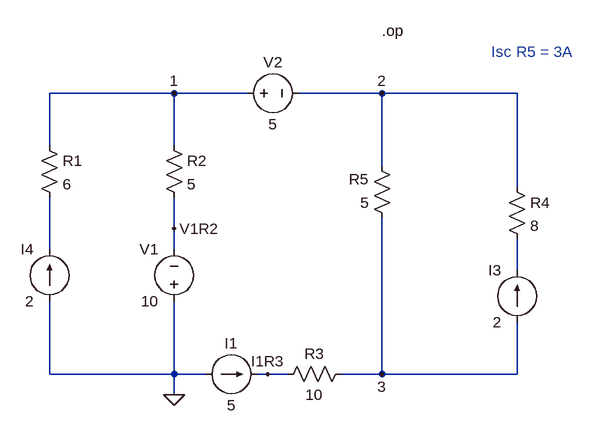
[diagram p0: schematic Circuit_tema1.asc]
Circuit_tema1.asc, the LTspice schematic file:
Version 4
SHEET 1 1772 680
WIRE 288 0 96 0
WIRE 400 0 288 0
WIRE 608 0 480 0
WIRE 816 0 608 0
WIRE 96 80 96 0
WIRE 288 80 288 0
WIRE 608 112 608 0
WIRE 816 144 816 0
WIRE 288 208 288 160
WIRE 96 240 96 160
WIRE 288 240 288 208
WIRE 816 272 816 224
WIRE 96 432 96 320
WIRE 288 432 288 320
WIRE 288 432 96 432
WIRE 336 432 288 432
WIRE 432 432 416 432
WIRE 464 432 432 432
WIRE 608 432 608 192
WIRE 608 432 544 432
WIRE 816 432 816 352
WIRE 816 432 608 432
WIRE 288 464 288 432
FLAG 288 0 1
FLAG 608 0 2
FLAG 608 432 3
FLAG 288 464 0
FLAG 288 208 V1R2
FLAG 432 432 I1R3
SYMBOL res 80 64 R0
SYMATTR InstName R1
SYMATTR Value 6
SYMBOL res 272 64 R0
SYMATTR InstName R2
SYMATTR Value 5
SYMBOL voltage 288 336 R180
WINDOW 0 24 96 Left 2
WINDOW 3 24 16 Left 2
SYMATTR InstName V1
SYMATTR Value 10
SYMBOL current 336 432 R270
WINDOW 0 32 40 VTop 2
WINDOW 3 -32 40 VBottom 2
SYMATTR InstName I1
SYMATTR Value 5
SYMBOL res 560 416 R90
WINDOW 0 0 56 VBottom 2
WINDOW 3 32 56 VTop 2
SYMATTR InstName R3
SYMATTR Value 10
SYMBOL voltage 384 0 R270
WINDOW 0 32 56 VTop 2
WINDOW 3 -32 56 VBottom 2
SYMATTR InstName V2
SYMATTR Value 5
SYMBOL res 800 128 R0
SYMATTR InstName R4
SYMATTR Value 8
SYMBOL current 816 352 R180
WINDOW 0 24 80 Left 2
WINDOW 3 24 0 Left 2
SYMATTR InstName I3
SYMATTR Value 2
SYMBOL current 96 320 R180
WINDOW 0 24 80 Left 2
WINDOW 3 24 0 Left 2
SYMATTR InstName I4
SYMATTR Value 2
SYMBOL res 624 208 R180
WINDOW 0 36 76 Left 2
WINDOW 3 36 40 Left 2
SYMATTR InstName R5
SYMATTR Value 5
TEXT 608 -96 Left 2 !.op
TEXT 776 -64 Left 2 ;Isc R5 = 3A

The netlist it stands for:
* Circuit_tema1.asc
R1 1 N001 6
R2 1 V1R2 5
V1 0 V1R2 10
I1 0 I1R3 5
R3 3 I1R3 10
V2 1 2 5
R4 2 N002 8
I3 3 N002 2
I4 0 N001 2
R5 3 2 5
.op
* Isc R5 = 3A
.backanno
.end